# EAGLE design Extruder_0 Board (EAGLE 9.1.3)
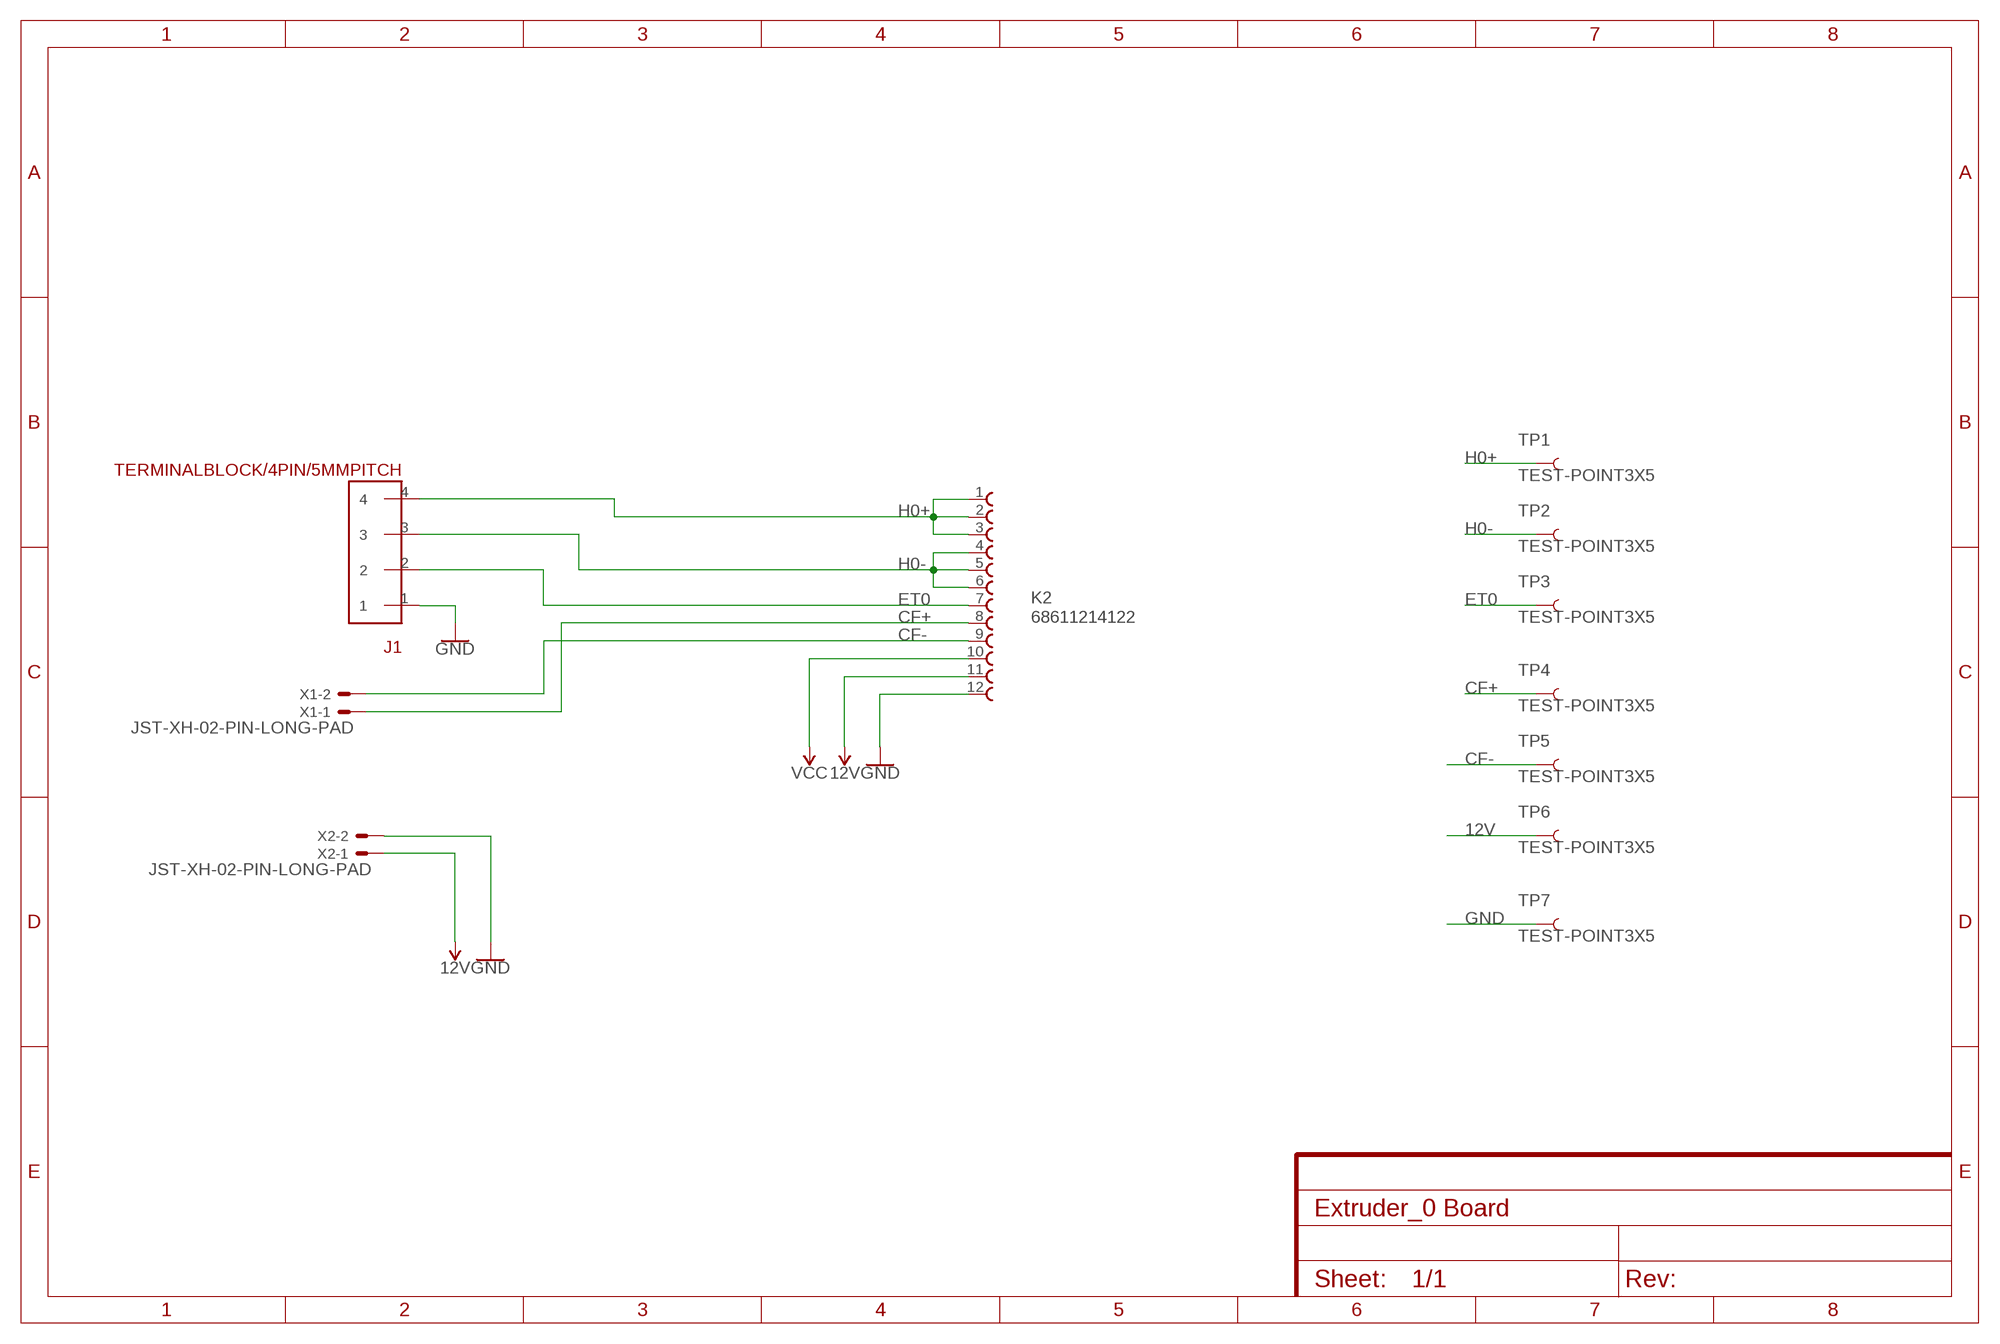
[diagram p0: schematic, sheet 1]

## Parts
J1  TERMINALBLOCK/4PIN/5MMPITCH  [TERMINALBLOCK/TOYO/4PIN/5MMPITCH]
K2  68611214122  [68611214122]
TP1  TEST-POINT3X5  [PAD.03X.05]
TP2  TEST-POINT3X5  [PAD.03X.05]
TP3  TEST-POINT3X5  [PAD.03X.05]
TP4  TEST-POINT3X5  [PAD.03X.05]
TP5  TEST-POINT3X5  [PAD.03X.05]
TP6  TEST-POINT3X5  [PAD.03X.05]
TP7  TEST-POINT3X5  [PAD.03X.05]
X1  JST-XH-02-PIN-LONG-PAD  [JST-XH-02-PACKAGE-LONG-PAD]
X2  JST-XH-02-PIN-LONG-PAD  [JST-XH-02-PACKAGE-LONG-PAD]

## Nets
12V: K2.11 TP6.P$1 X2.1
CF+: K2.8 TP4.P$1 X1.1
CF-: K2.9 TP5.P$1 X1.2
ET0: J1.2 K2.7 TP3.P$1
GND: J1.1 K2.12 TP7.P$1 X2.2
H0+: J1.4 K2.1 K2.2 K2.3 TP1.P$1
H0-: J1.3 K2.4 K2.5 K2.6 TP2.P$1
VCC: K2.10

## Library data of the parts
J1 = FracktalWorks_Eagle_Library:TERMINALBLOCK/4PIN/5MMPITCH
K2 = Wurth_Elektronik_Electromechanic_FPC_Connectors_&_Flat_Flexible_Cable_rev15b:68611214122: WR-FPC 1.00mm SMT ZIF Horizontal Top Contact, 12 Pins=>Code : Con_FPC_ZIF_1.00_68611214122 <http://katalog.we-online.de/media/images/eican/Con_FPC_ZIF_1.00_6861xx14122_pf2.jpg> Details see: http://katalog.we-online.de/en/em/686_1xx_141_22 Created 2014-07-09, Karrer Zheng 2014 (C) Würth Elektronik
TP1-TP7 = SparkFun-Connectors:TEST-POINT: SparkFun Test Points Bare copper test points for troubleshooting or In-Circuit-Testing. These are used by our Production team for verifying production board runs using pogo-pins on test beds. SparkFun Products: SparkFun LSM9DS1 Breakout <https://www.sparkfun.com/products/13284> SparkFun PSOC <https://www.sparkfun.com/products/13714> SparkFun Load Cell Amplifier <https://www.sparkfun.com/products/13879>
X1 X2 = Rembrandt Electronics - JST XH Connectors v1-0:JST-XH-02-PIN: JST XH Connector 2 Pin Wire to board connector. Pitch: 2,54 mm, (0.100") Number of pins: 2 Created by Rembrandt Electronics www.rembrandtelectronics.com

## Board
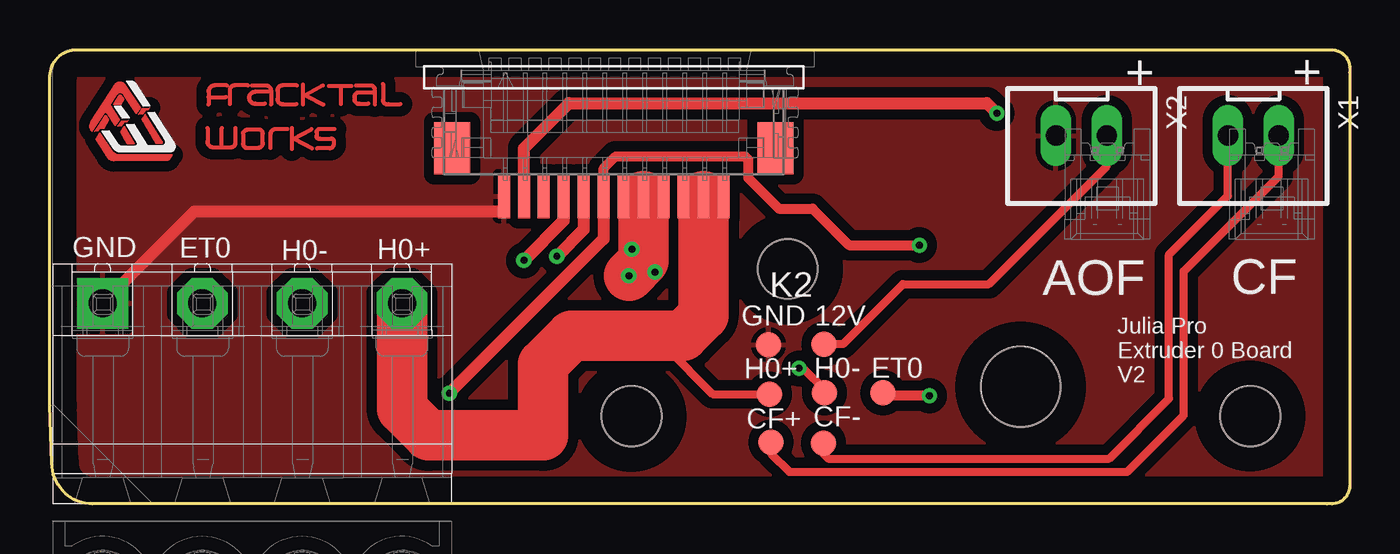
[diagram p1: board, top side]
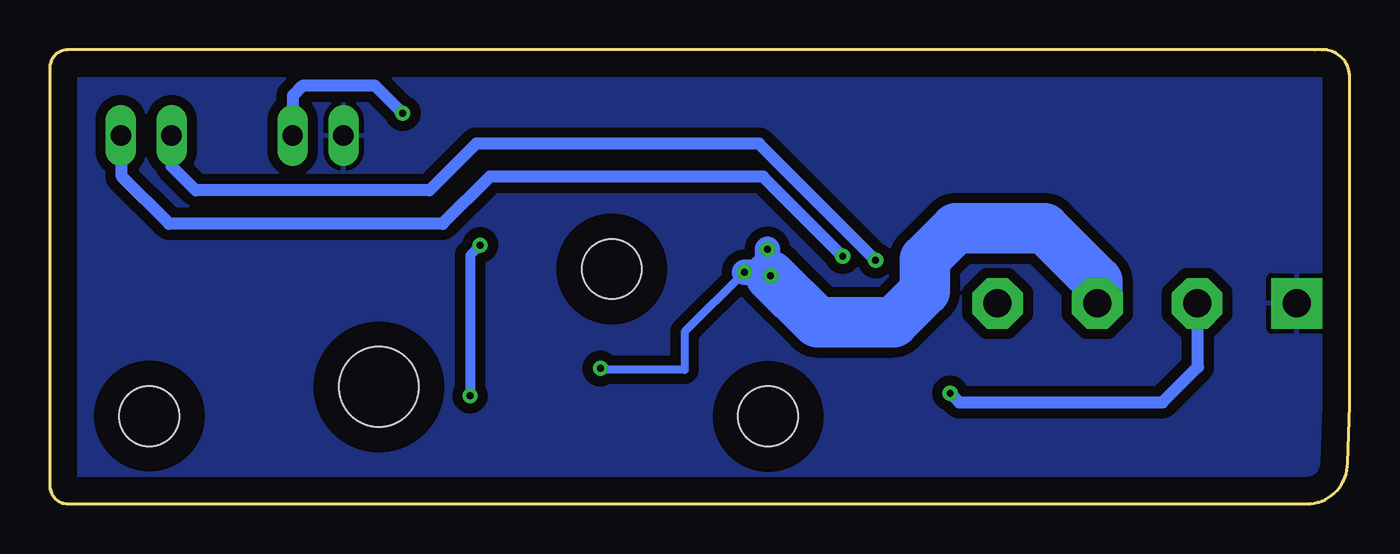
[diagram p2: board, bottom side, seen from below]

Size 65.13 x 22.73 mm. Coordinates in mm from the lower left corner, seen from the top.
Outline: 1.12,22.73 1.75,22.73
Outline: 1.75,22.73 64.24,22.73 arc-90 65.13,21.84 65.13,21.59 65.13,0.89 arc-90 64.24,0 63.98,0 2.13,0 arc-90 0.1,2.03 0,4.93 0,21.44 arc-90 1.37,22.73 1.75,22.73
Copper layers (1*16): Top 0.035mm / dielectric 1.5mm / Bottom 0.035mm
Design rules "LionCircuits": minimum track width 8mil, minimum drill 0.35mm, track to track 8mil, track to pad 8mil, pad to pad 8mil, via to via 8mil, smd to smd 8mil, copper to edge 50mil, drill to drill 10mil, minimum pad ring 10mil, minimum via ring 8mil, stop-mask expansion 4mil, vias tented up to drill 0mil, thermal gap 10mil
Holes 3 mm at 29.14,4.38 60.14,4.39 36.97,11.76
Holes 4 mm at 48.64,5.86

### Footprints (pad centres in the part's own frame; a part is rotated, then mirrored left to right if it is on the bottom)
TERMINALBLOCK/TOYO/4PIN/5MMPITCH = drill 1.4 pad 2.54 square: 1 0,0 | drill 1.4 pad 2.54 octagon: 2 5,0; 3 10,0; 4 15,0
68611214122 = smd 0.6 x 2.2: 1 -8.5,1.1; 2 -7.5,1.1; 3 -6.5,1.1; 4 -5.5,1.1; 5 -4.5,1.1; 6 -3.5,1.1; 7 -2.5,1.1; 8 -1.5,1.1; 9 -0.5,1.1; 10 0.5,1.1; 11 1.5,1.1; 12 2.5,1.1 | smd 1.8 x 2.6: Z1 -11.1,-1.3; Z2 5.1,-1.3
PAD.03X.05 = smd 1.27 x 1.27: P$1 0,0
JST-XH-02-PACKAGE-LONG-PAD = drill 1.016 long: 1 -1.27,0; 2 1.27,0

### Placement (x,y rotation side)
J1  2.64,10.03 0 top
K2  25.25,16.51 180 top
TP1  36.06,5.5 0 top
TP2  38.8,5.57 0 top
TP3  41.74,5.57 0 top
TP4  36.14,3.09 0 top
TP5  38.76,3.03 0 top
TP6  38.78,8 0 top
TP7  36.01,7.97 0 top
U$1  FWLOGO_SMALL_FOOTPRINT  [FWLOGO_SMALL]  1.75,16.03 0 top
X1  60.3,18.44 180 top
X2  51.69,18.44 180 top

### Tracks (layer width: path | path; a pad name or v marks a point on that pad's centre or on a via)
12V  (via drill 0.35)
  Top 0.406: X2.1 52.96,16.92 47.04,11 42.74,11 39.74,8 TP6.P$1
  Top 0.61: K2.11 23.75,17.8 26.01,20.07 46.94,20.07 v47.45,19.56
  Bottom 0.61: v47.45,19.56 48.82,20.93 52.48,20.93 52.96,20.45 X2.1
CF+  (via drill 0.35)
  Top 0.406: TP4.P$1 36.14,2.52 37.06,1.6 53.98,1.6 56.81,4.43 56.81,11.66 61.57,16.42 X1.1
  Top 0.61: K2.8 26.75,13.74 v25.4,12.4
  Bottom 0.61: v25.4,12.4 29.39,16.38 43.08,16.38 45.44,14.02 59.16,14.02 61.52,16.38 61.52,18.39 X1.1
CF-  (via drill 0.35)
  Top 0.406: TP5.P$1 38.76,2.52 39.01,2.27 53.08,2.27 56.08,5.27 56.08,12.48 59.03,15.43 X1.2
  Top 0.61: K2.9 25.75,14.19 v23.75,12.19
  Bottom 0.61: v23.75,12.19 29.59,18.03 43.76,18.03 46.1,15.7 57.81,15.7 59.03,16.92 X1.2
ET0  (via drill 0.35)
  Top 0.406: TP3.P$1
  Top 0.508: K2.7 27.75,16.8 28.35,17.4 34.84,17.4 34.99,17.25 34.99,16.32 36.53,14.78 38.22,14.78 40.05,12.95 v43.56,12.95 | v44.07,5.41 41.9,5.41 TP3.P$1
  Top 0.61: K2.7 27.75,13.27 v20.02,5.54
  Bottom 0.508: v43.56,12.95 44.07,12.45 v44.07,5.41
  Bottom 0.61: v20.02,5.54 19.56,5.08 9.37,5.08 7.59,6.86 7.59,9.99 J1.2
GND
  Top 0.61: K2.12 22.75,14.77 22.61,14.63 7.24,14.63 J1.1
  pour Bottom (isolate 0.508): -0.36,22.22 64.85,22.22 64.85,-0.05 -0.36,-0.05
  pour Top (isolate 0.508): -0.3,22.4 64.82,22.4 64.82,0 -0.3,0
H0+
  Top 0.406: 30.84,7.87 33.21,5.5 TP1.P$1 | 31.73,8.42 31.47,8.16
  Top 0.61: K2.3 K2.2 K2.1 | K2.3 32.68,14.48 32.75,14.48 32.82,14.48 K2.1 | K2.3 32.49,16 33.5,16 K2.1
  Top 0.813: 31.47,8.16 31.18,7.87 30.84,7.87
  Top 1.27: K2.2 32.75,14.48
  Top 2.54: K2.2 32.75,9.44 31.73,8.42 26.15,8.42 24.71,6.98 24.71,3.43 18.97,3.43 17.64,4.76 J1.4
H0-  (via drill 0.35)
  Top 0.406: v37.54,6.78 37.74,6.78 38.8,5.73 TP2.P$1
  Top 0.61: K2.6 K2.5 K2.4 | K2.6 29.55,14.61 29.75,14.61 29.94,14.61 K2.4 | K2.6 28.75,15.82 28.93,16 30.58,16 K2.4
  Top 1.27: K2.5 29.75,14.61
  Top 2.54: K2.5 29.75,12.17 v29.01,11.43
  Bottom 0.406: v30.33,11.61 33.32,8.61 33.32,6.71 37.47,6.71 v37.54,6.78
  Bottom 1.27: v29.16,12.75 29.16,11.58 v29.01,11.43 29.18,11.61 v30.33,11.61
  Bottom 2.54: v29.01,11.43 26.67,9.09 22.86,9.09 21.29,10.67 21.29,12.24 19.74,13.79 15.29,13.79 12.64,11.14 J1.3

### Text on the board
tPlace: + | + | GND | ET0 | H0- | H0+ | AOF | CF | GND | 12V | H0+ | H0- | ET0 | Julia Pro / Extruder 0 Board / V2 | CF- | CF+